# EAGLE design NodeMCU AC Switch (EAGLE 7.5.0)
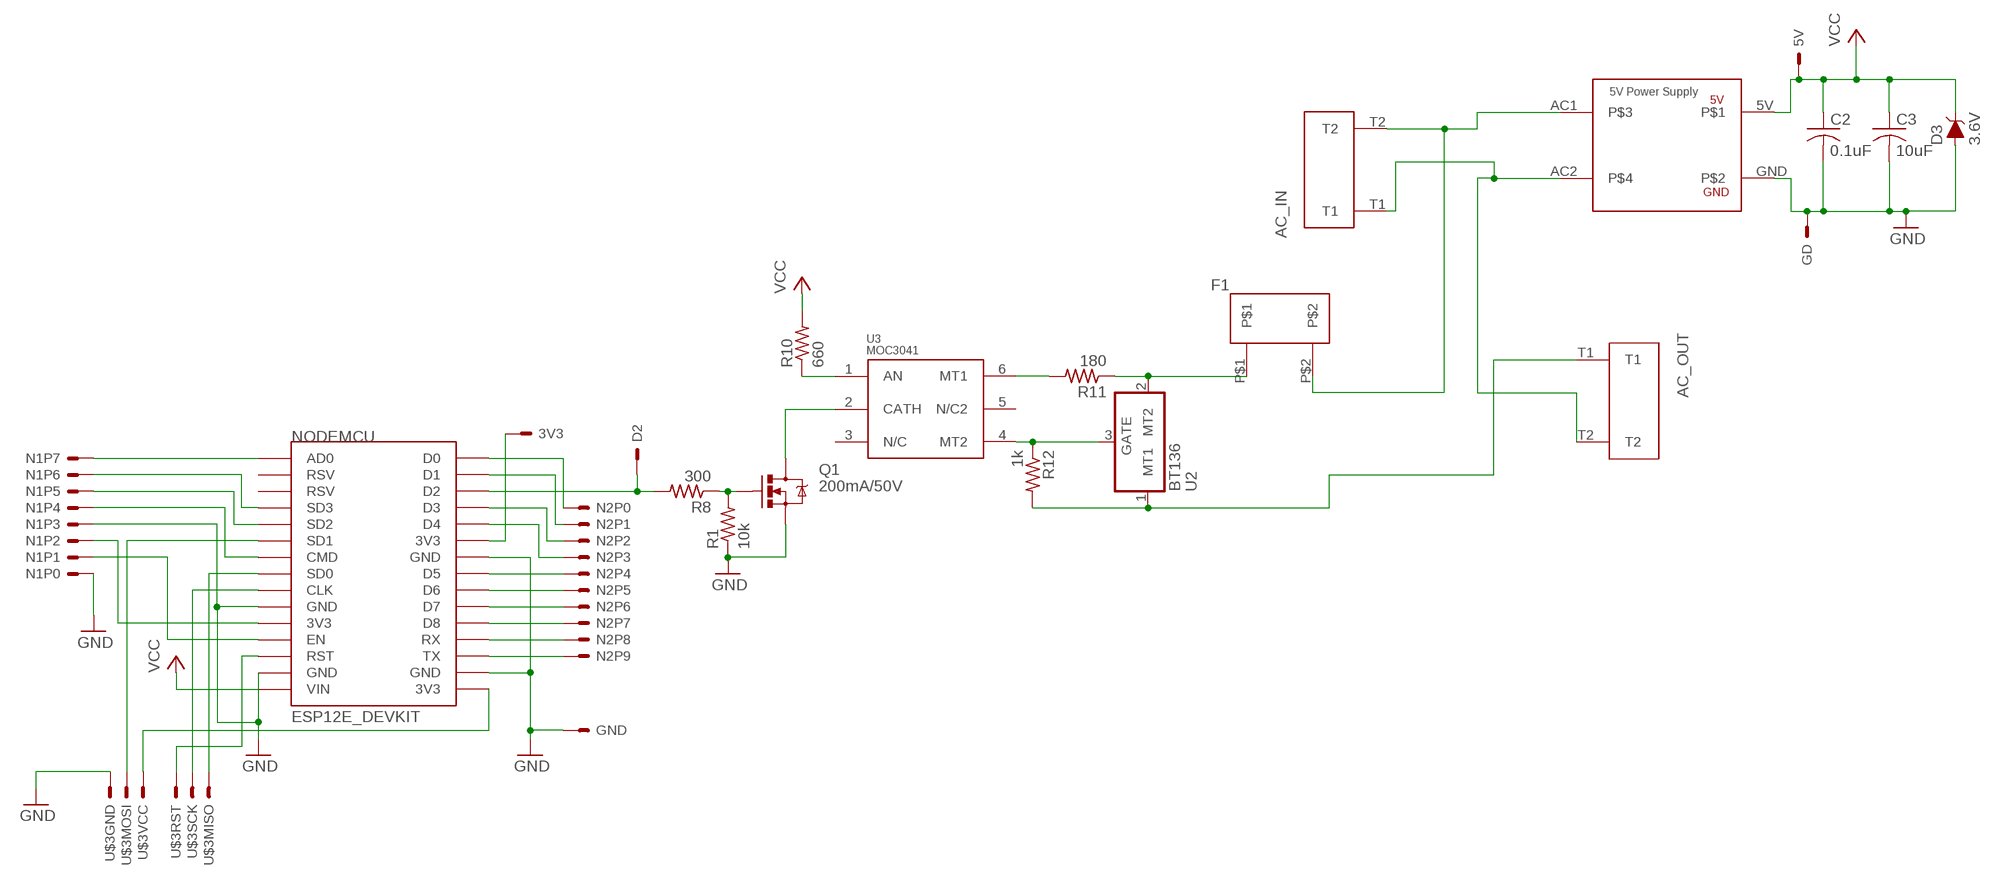
[diagram p0: schematic, sheet 1]

## Parts
3V3  1PINHEADER_S  [1PINHEADER_S]
5V  1PINHEADER_S  [1PINHEADER_S]
AC_IN  2PIN_SCREW_TERM  [2PIN_SCREW_TERM]
AC_OUT  2PIN_SCREW_TERM  [2PIN_SCREW_TERM]
C2  0.1uF  C-USC1206  [C1206]
C3  10uF  C-USC1206  [C1206]
D2  1PINHEADER_S  [1PINHEADER_S]
D3  3.6V  DIODE-ZENER-BZT52C3V6S  [SOD-323]
F1  FUSE_HOLDER  [FUSE_HOLDER]
GD  1PINHEADER_S  [1PINHEADER_S]
GND  1PINHEADER_S  [1PINHEADER_S]
N1  8PINHEADER  [8PINHEADER]
N2  10PINHEADER  [10PINHEADER]
NODEMCU  ESP12E_DEVKIT  [ESP12E_DEVKIT]
Q1  200mA/50V  MOSFET-NCHANNELBSS138  [SOT23-3]
R1  10k  R-US_R1206  [R1206]
R8  300  R-US_R1206  [R1206]
R10  660  R-US_R1206  [R1206]
R11  180  R-US_R1206  [R1206]
R12  1k  R-US_R1206  [R1206]
U2  BT136  [BT136]
U3  MOC3041  [MOC3041]
U$2  5V_POWER_SUPPLY  [5V_POWER_SUPPLY]
U$3  2X3_HEADER  [2X3_HEADER]

## Nets
GND: C2.2 C3.2 D3.A GD.P$1(S) GND.P$1(S) N1.P0 N1.P3 NODEMCU.GND@0(GND) NODEMCU.GND@1(GND) NODEMCU.GND@2(GND) NODEMCU.GND@3(GND) Q1.2(S) R1.1 U$2.GND U$3.GND
N$1: D2.P$1(S) NODEMCU.D2 R8.2
N$2: NODEMCU.SD1 U$3.MOSI
N$3: NODEMCU.SD0 U$3.MISO
N$4: NODEMCU.RST U$3.RST
N$5: NODEMCU.CLK U$3.SCK
N$6: NODEMCU.3V3@2(3V3) U$3.VCC
N$7: Q1.3(D) U3.2(CATH)
N$8: F1.P$1 R11.1 U2.2(MT2)
N$9: N1.P7 NODEMCU.AD0
N$10: N1.P6 NODEMCU.SD3
N$11: N1.P5 NODEMCU.SD2
N$12: N1.P4 NODEMCU.CMD
N$13: N2.P0 NODEMCU.D0
N$14: N1.P2 NODEMCU.3V3@0(3V3)
N$15: N1.P1 NODEMCU.EN
N$16: N2.P1 NODEMCU.D1
N$17: N2.P2 NODEMCU.D3
N$18: AC_IN.T1 AC_OUT.T2 U$2.AC2
N$19: N2.P3 NODEMCU.D4
N$20: N2.P4 NODEMCU.D5
N$21: N2.P5 NODEMCU.D6
N$22: N2.P6 NODEMCU.D7
N$23: N2.P7 NODEMCU.D8
N$24: Q1.1(G) R1.2 R8.1
N$25: N2.P8 NODEMCU.RX
N$26: N2.P9 NODEMCU.TX
N$27: 3V3.P$1(S) NODEMCU.3V3@1(3V3)
N$29: AC_IN.T2 F1.P$2 U$2.AC1
N$39: R10.1 U3.1(AN)
N$40: R11.2 U3.6(MT1)
N$41: R12.1 U2.3(GATE) U3.4(MT2)
N$45: AC_OUT.T1 R12.2 U2.1(MT1)
VCC: 5V.P$1(S) C2.1 C3.1 D3.C NODEMCU.VIN R10.2 U$2.5V
Unconnected: NODEMCU.RSV@0(RSV) NODEMCU.RSV@1(RSV) U3.3(N/C) U3.5(N/C2)

## Library data of the parts
3V3 5V D2 GD GND = ForceTronics:1PINHEADER_S: 1 pin header with round pad
AC_IN AC_OUT = ForceTronics:2PIN_SCREW_TERM: 2 pin screw terminal 5mm pin spacing 10mm length 8mm depth
C2 C3 = rcl:C-US: CAPACITOR, American symbol
D3 = SparkFun-DiscreteSemi:DIODE-ZENER: Zener Diode A Zener diode allows current to flow from its anode to its cathode like a normal semiconductor diode, but it also permits current to flow in the reverse direction when its "Zener voltage" is reached. - WIkipedia; PROD_ID: DIO-08199
F1 = ForceTronics:FUSE_HOLDER: 5mm x 20mm Fuse Holder
N1 = ForceTronics:8PINHEADER
N2 = ForceTronics:10PINHEADER
NODEMCU = ESP12E_DEVKIT:ESP12E_DEVKIT: ESP12E DEVKIT BOARD
Q1 = SparkFun-DiscreteSemi:MOSFET-NCHANNEL: Common NMOSFET Parts MFG P/N Store ID Prod ID FDD8780 TRANS-09984 SI7820DN TRANS-11055 FDS6630A IC-08089 2N7002PW TRANS-11151 FQP30N06L COM-10213 TRANS-10060 BSS123LT1G TRANS-08345 BSS138 TRANS-00830 BS170 2N7000; PROD_ID: TRANS-00830
R1 R8 R10-R12 = rcl:R-US_: RESISTOR, American symbol
U2 = ForceTronics:BT136: BT136 Triac: pin 1 is main terminal 1, pin 2 is main terminal 2, pin 3 is Gate
U3 = ForceTronics:MOC3041: MOC 3041 opto isolator: pin 1 is anode, pin 2 is cathode, pin 3 is N/C, pin 4 is MT2, pin 5 is N/C, pin 6 is MT1
U$2 = ForceTronics:5V_POWER_SUPPLY: Integrated 5V power supply. Input AC pins are interchangable. Note that the part has components on the bottom so needs to sit up from PCB board and no ground plane underneath
U$3 = ForceTronics:2X3_HEADER: 2x3 pin header with 0.1" spacing. Orginally made for SPI header

## Board
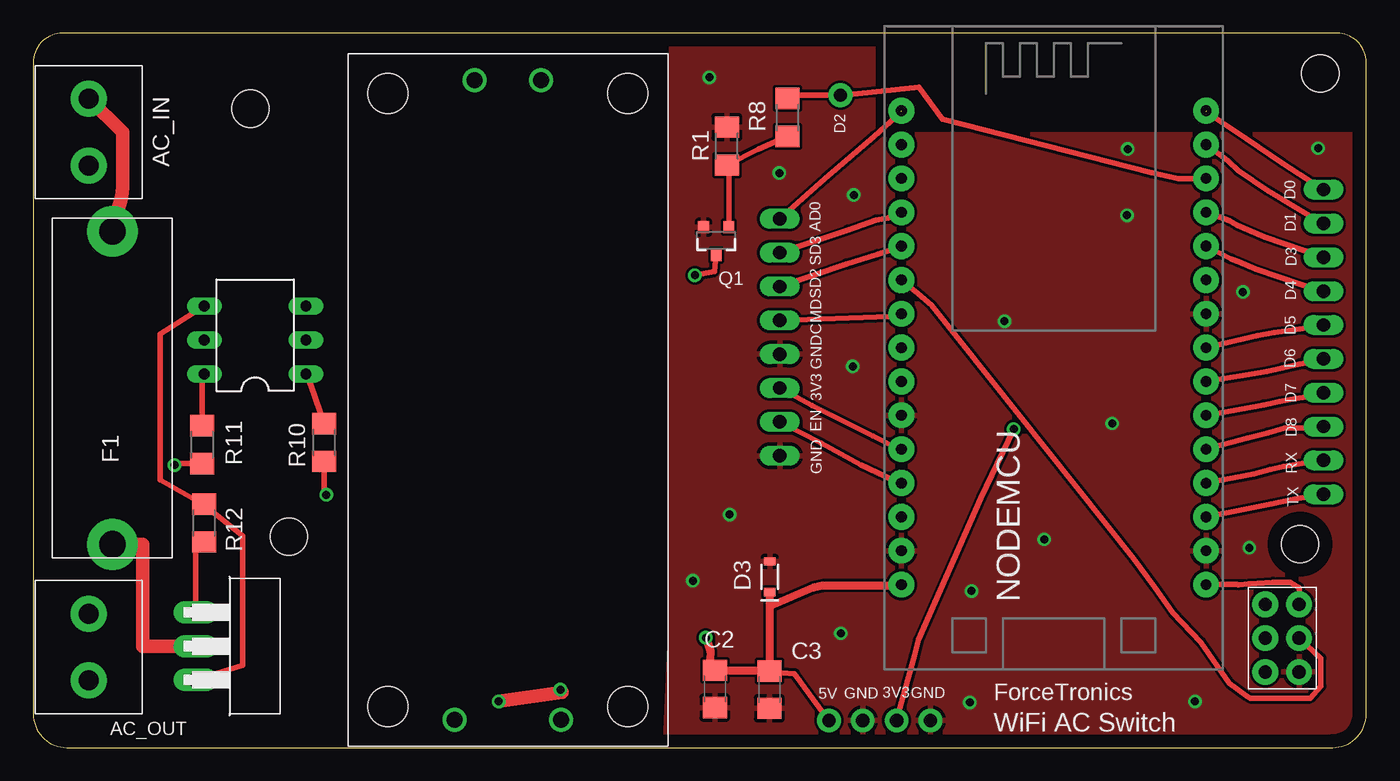
[diagram p1: board, top side]
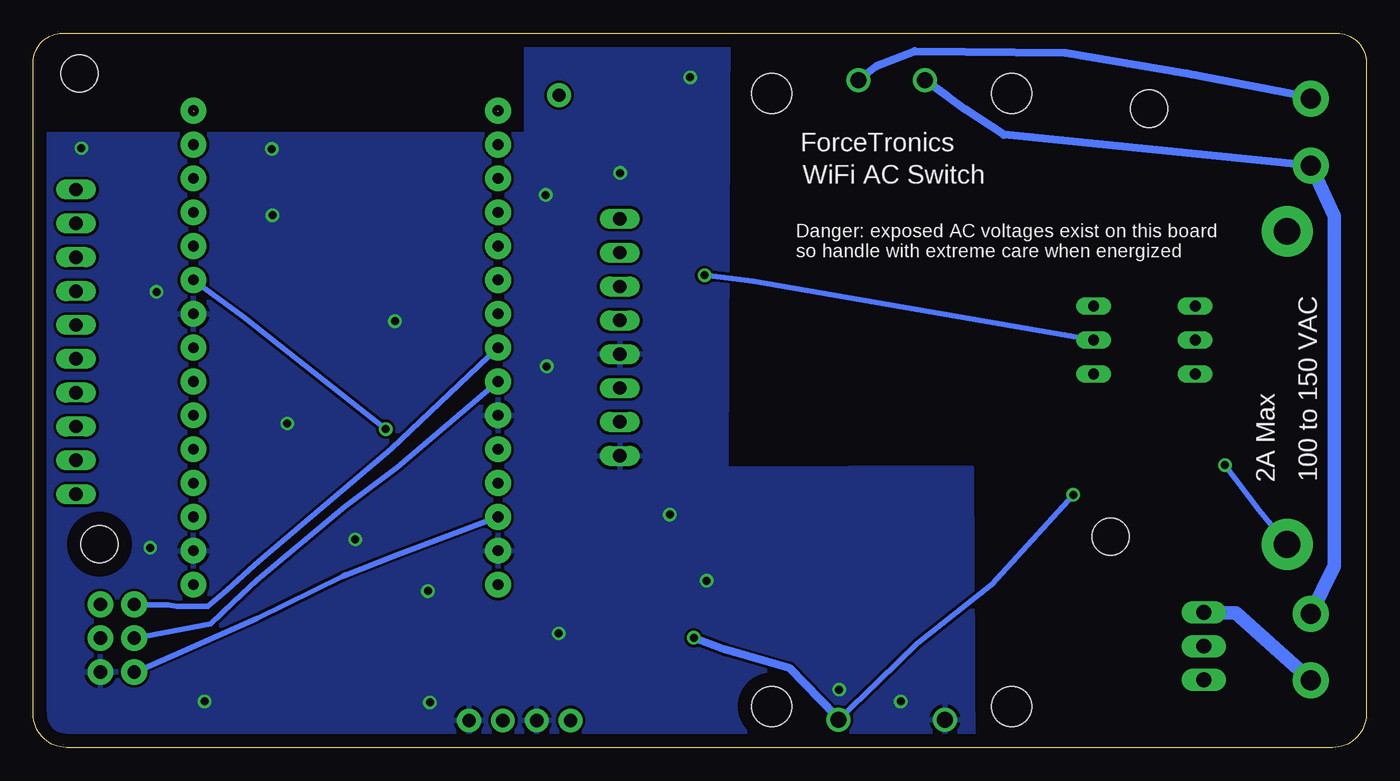
[diagram p2: board, bottom side, seen from below]

Size 100 x 53.6 mm. Coordinates in mm from the lower left corner, seen from the top.
Outline: 0,51.41 0,2.5 arc90 2.5,0 97.5,0 arc90 100,2.5 100,51.41 arc90 97.81,53.6 2.19,53.6 arc90 0,51.41
Copper layers (1*16): Top 0.035mm / dielectric 1.5mm / Bottom 0.035mm
Design rules "default": minimum track width 10mil, minimum drill 24mil, track to track 8mil, track to pad 8mil, pad to pad 8mil, via to via 8mil, smd to smd 8mil, copper to edge 40mil, drill to drill 8mil, minimum pad ring 10mil, minimum via ring 8mil, stop-mask expansion 4mil, vias tented up to drill 0mil, thermal gap 10mil
Holes 2.8 mm at 16.29,47.95 96.55,50.58 95.03,15.27 19.18,15.82

### Footprints (pad centres in the part's own frame; a part is rotated, then mirrored left to right if it is on the bottom)
1PINHEADER_S = drill 1 pad 1.778: P$1 1.27,1.27
2PIN_SCREW_TERM = drill 1.5 pad 2.7: T1 2.5,4; T2 7.5,4
C1206 = smd 1.6 x 1.8: 1 -1.4,0; 2 1.4,0
SOD-323 = smd 0.63 x 0.83: A 1.15,0; C -1.15,0
FUSE_HOLDER = drill 2 pad 3.81: P$1 1,4.5; P$2 24.5,4.5
8PINHEADER = drill 1 long: P0 1.27,-3.81; P1 3.81,-3.81; P2 6.35,-3.81; P3 8.89,-3.81; P4 11.43,-3.81; P5 13.97,-3.81; P6 16.51,-3.81; P7 19.05,-3.81
10PINHEADER = drill 1 long: P0 1.27,-3.81; P1 3.81,-3.81; P2 6.35,-3.81; P3 8.89,-3.81; P4 11.43,-3.81; P5 13.97,-3.81; P6 16.51,-3.81; P7 19.05,-3.81; P8 21.59,-3.81; P9 24.13,-3.81
ESP12E_DEVKIT = drill 0.8 pad 1.93: 3V3@0 -11.43,-7.62; 3V3@1 11.43,5.08; 3V3@2 11.43,-17.78; AD0 -11.43,17.78; CLK -11.43,-2.54; CMD -11.43,2.54; D0 11.43,17.78; D1 11.43,15.24; D2 11.43,12.7; D3 11.43,10.16; D4 11.43,7.62; D5 11.43,0; D6 11.43,-2.54; D7 11.43,-5.08; D8 11.43,-7.62; EN -11.43,-10.16; GND@0 -11.43,-5.08; GND@1 -11.43,-15.24; GND@2 11.43,2.54; GND@3 11.43,-15.24; RST -11.43,-12.7; RSV@0 -11.43,15.24; RSV@1 -11.43,12.7; RX 11.43,-10.16; SD0 -11.43,0; SD1 -11.43,5.08; SD2 -11.43,7.62; SD3 -11.43,10.16; TX 11.43,-12.7; VIN -11.43,-17.78
SOT23-3 = smd 0.8 x 0.9: 1 -0.95,-1; 2 0.95,-1; 3 0,1.1
R1206 = smd 1.6 x 1.803: 1 -1.422,0; 2 1.422,0
BT136 = drill 1.118 long: 1 2.54,-2.54; 2 5.08,-2.54; 3 7.62,-2.54
MOC3041 = drill 0.813 long: 1 1.26,-0.86; 2 3.8,-0.86; 3 6.34,-0.86; 4 6.34,6.76; 5 3.8,6.76; 6 1.26,6.76
5V_POWER_SUPPLY = drill 1.2: 5V 50,16; AC1 2,14.5; AC2 2,9.5; GND 50,8 | hole 3: 3,3; 3,21; 49,21; 49,3
2X3_HEADER = drill 1 pad 1.93: GND 6.35,3.81; MISO 1.27,1.27; MOSI 3.81,3.81; RST 6.35,1.27; SCK 3.81,1.27; VCC 1.27,3.81

### Placement (x,y rotation side)
3V3  63.5,0.76 0 top
5V  58.42,0.76 0 top
AC_IN  8.16,41.18 90 top
AC_OUT  8.16,2.54 90 top
C2  51.13,4.4 270 top
C3  55.23,4.35 270 top
D2  59.28,47.68 0 top
D3  55.25,12.82 90 top
F1  10.43,14.24 90 top
GD  66.04,0.76 0 top
GND  60.96,0.76 0 top
N1  52.19,20.63 90 top
N2  100.6,43.14 270 top
NODEMCU  76.56,30.01 0 top
Q1  51.23,38.05 180 top
R1  1k  [R1206]  52.03,45.13 270 top
R8  1k  [R1206]  56.57,47.29 90 top
R10  1k  [R1206]  21.83,22.89 270 top
R11  12.67,22.73 90 top
R12  12.83,16.85 270 top
U2  14.72,12.69 270 top
U3  19.59,26.78 90 top
U$2  23.61,52.08 270 top
U$3  91.16,12.02 270 top

### Tracks (layer width: path | path; a pad name or v marks a point on that pad's centre or on a via)
GND  (via drill 0.6)
  Top 0.61: 39.68,4.15 v39.54,4.35
  Top 1.016: v34.92,3.46 39.68,4.15
  other vias: 72.87,31.99 82.05,39.94 90.75,34.2 82.11,44.91 50.72,50.3 96.4,44.98 91.23,15 87.15,3.46 52.24,17.48 75.84,15.62 70.39,11.75 80.95,24.32 60.59,8.57 61.56,41.46 61.49,28.61 55.97,43.12 70.25,3.39 49.48,12.51
  pour Bottom: 29.5,-1 29.63,20.97 48.02,20.91 47.88,55 63,55 63,46 101,46 101,-1
  pour Top: 47.38,-0.37 47.51,2.04 47.77,7.67 47.88,54.97 63,55 63,46 101,46 101,-1
N$1
  Top 0.406: R8.2 56.57,48.95 D2.P$1 61.15,49 66.45,49.54 68.21,47.16 83.88,43.13 85.92,42.7 NODEMCU.D2
N$2
  Top 0.406: U$3.MOSI 96.6,6.7 96.6,4.6 95.8,3.7 91.3,3.7 91,3.9 89.75,4.82 87.6,7.9 85.5,10.1 84.13,12.03 82.56,14.15 67.38,33.19 66.36,34.07 NODEMCU.SD1
N$3
  Bottom 0.406: U$3.MISO 92.43,10.7 89.9,10.7 89.2,10.6 86.9,10.6 85.5,11.8 83.4,13.7 82.3,14.64 73.16,22.4 NODEMCU.SD0
N$4
  Bottom 0.406: 76.6,12.94 76.8,12.84 | 76.8,12.84 83.2,9.7 92.43,5.6 U$3.RST | NODEMCU.RST 72.7,14.47 76.8,12.84
N$5
  Bottom 0.406: U$3.SCK 86.7,9.3 85,10.9 83.2,12.6 76.6,18.1 72.72,21.02 NODEMCU.CLK
N$6
  Top 0.406: U$3.VCC 94.97,12 94.3,12.4 93,12.4 91.21,12.28 90.41,12.22 90.3,12.23 NODEMCU.3V3@2
N$7  (via drill 0.6)
  Top 0.406: v49.64,35.44 51.1,35.72 Q1.3
  Bottom 0.406: U3.2 46.05,35.01 v49.64,35.44
N$8  (via drill 0.6)
  Top 0.406: R11.1 10.6,21.31 v10.6,21.2
  Top 1.016: F1.P$1 8.2,15.24 8.2,7.6 U2.2
  Bottom 0.406: v10.6,21.2 8.03,17.8 F1.P$1
N$9  (1 unrouted)
  Top 0.406: N1.P7 59.4,42.68 63.1,45.9 65.12,47.7
N$10
  Top 0.406: N1.P6 61.1,38.84 63.2,39.6 64.1,39.74 NODEMCU.SD3
N$11
  Top 0.406: N1.P5 61,36.3 63.3,37 64.97,37.56 64.93,37.57 NODEMCU.SD2
N$12
  Top 0.406: N1.P4 64.32,32.36 64.86,32.5 NODEMCU.CMD
N$13  (1 unrouted)
  Top 0.406: N2.P0 93.7,43.87 91,45.7 87.98,47.7
N$14
  Top 0.406: N1.P2 58.4,25.68 63,23.4 65.12,22.3 65.13,22.3 NODEMCU.3V3@0
N$15
  Top 0.406: N1.P1 59.1,22.84 62.1,21.2 65.12,19.8 65.13,19.8 NODEMCU.EN
N$16
  Top 0.406: N2.P1 96.79,39.3 92.6,41.8 90.4,43.28 89.6,44.06 NODEMCU.D1
N$17
  Top 0.406: N2.P2 92.4,38.3 90.3,39.2 89.73,39.54 NODEMCU.D3
N$18
  Bottom 0.61: AC_IN.T1 27.2,45.98 30.1,47.9 31.42,48.9 U$2.AC2
  Bottom 1.016: AC_OUT.T2 2.4,13.64 2.4,39.9 4.16,43.7 AC_IN.T1
N$19
  Top 0.406: N2.P3 96.79,34.2 91.7,35.9 90.4,36.46 89.89,36.67 NODEMCU.D4
N$20
  Top 0.406: N2.P4 95,31.4 93.1,31.14 91.86,30.91 NODEMCU.D5
N$21
  Top 0.406: N2.P5 96.79,29.1 95,28.8 93.7,28.5 92.56,28.21 NODEMCU.D6
N$22
  Top 0.406: N2.P6 96.79,26.5 94.7,26.2 93.5,25.96 92.31,25.72 NODEMCU.D7
N$23
  Top 0.406: N2.P7 96.79,24 93.9,24 92.6,23.62 91.12,23.24 NODEMCU.D8
N$24
  Top 0.406: R8.1 56.6,45.87 54.4,44.9 R1.2 52.18,43.71 Q1.1
N$25
  Top 0.406: N2.P8 96.79,21.6 93.8,21.1 92.8,20.88 91.55,20.53 NODEMCU.RX
N$26
  Top 0.406: N2.P9 94.69,18.64 92.88,18.27 NODEMCU.TX
N$27  (via drill 0.6)
  Top 0.406: v73.56,23.9 71.09,18.72 66.4,8.08 66.09,6.88 3V3.P$1
  Bottom 0.406: v73.56,23.9 81.56,30.22 84.25,32.33 NODEMCU.3V3@1
N$29
  Top 1.016: AC_IN.T2 6.7,46.19 6.71,42.02 6.62,41.33 F1.P$2
  Bottom 0.61: U$2.AC1 36.78,51.12 33.87,52.26 22.55,52.13 13.48,50.6 4.16,48.8
  Bottom 1.016: 4.16,48.8 AC_IN.T2
N$39
  Top 0.406: U3.1 20.83,27.14 R10.1
N$40
  Top 0.406: U3.6 12.67,28.04 R11.2
N$41
  Top 0.406: U3.4 9.5,31.02 9.5,20.1 12.83,18.2 | U2.3 15.7,6.17 15.7,15.9 12.83,18.2 | 12.83,18.2 R12.1
N$45
  Top 0.406: R12.2 12.18,15.43 U2.1
  Bottom 1.016: AC_OUT.T1 4.7,5.54 9.8,10.1 12.18,10.1 U2.1
VCC  (via drill 0.6)
  Top 0.406: 5V.P$1 59.66,2.03 57.12,5.54 55.23,5.69 C3.1 | v21.98,18.97 21.83,18.97 R10.2
  Top 0.61: 55.25,10.6 55.25,5.75 C3.1 55.23,5.8 C2.1 50.78,6.57 50.8,7.23 v50.45,8.24 | 55.25,10.6 58.5,12 59.3,12.16 65.13,12.16 NODEMCU.VIN | 55.25,10.6 D3.C
  Bottom 0.406: U$2.5V 36.56,4.99 33.66,7.83 28.07,12.26 v21.98,18.97
  Bottom 0.61: U$2.5V 39.8,2.39 43.23,5.94 48.04,7.34 v50.45,8.24

### Text on the board
tNames: D2 | D0 | D1 | AD0 | D3 | SD3 | D4 | SD2 | D5 | CMD | D6 | GND | D7 | 3V3 | D8 | EN | RX | GND | TX | 3V3 | 5V | GND | GND | ForceTronics | WiFi AC Switch
bNames: ForceTronics | WiFi AC Switch | Danger: exposed AC voltages exist on this board / so handle with extreme care when energized | 100 to 150 VAC | 2A Max